# EAGLE schematic board 3 (EAGLE 9.6.2)
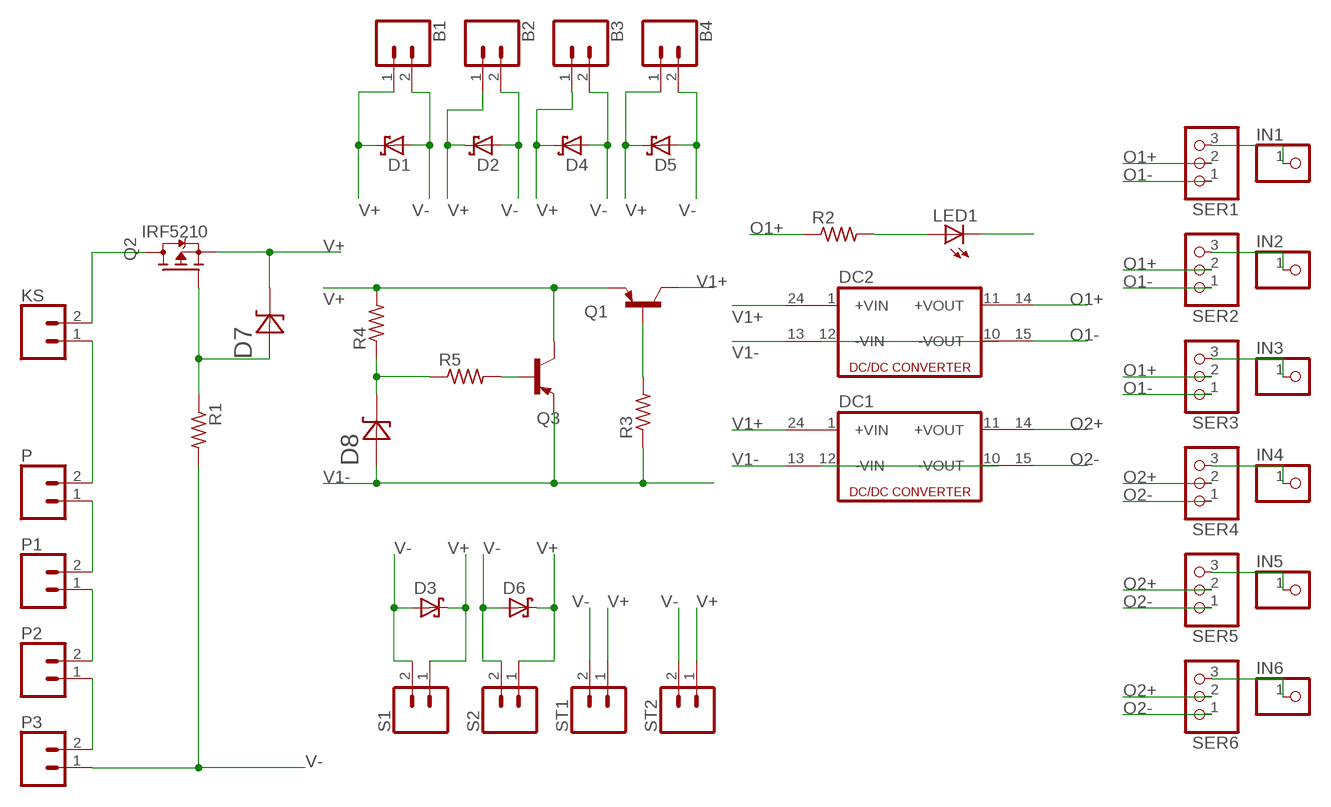
[diagram p0: schematic, sheet 1]

## Parts
B1  CONN_02  [1X02]
B2  CONN_02  [1X02]
B3  CONN_02  [1X02]
B4  CONN_02  [1X02]
D1  SCHOTTKY-DIODEF126Z12  [F126Z12]
D2  SCHOTTKY-DIODEF126Z12  [F126Z12]
D3  SCHOTTKY-DIODEF126Z12  [F126Z12]
D4  SCHOTTKY-DIODEF126Z12  [F126Z12]
D5  SCHOTTKY-DIODEF126Z12  [F126Z12]
D6  SCHOTTKY-DIODEF126Z12  [F126Z12]
D7  1N4752A-T  [DIOAD1060W80L410D260]
D8  1N4752A-T  [DIOAD1060W80L410D260]
DC1  DC213R  [CMK]
DC2  DC213R  [CMK]
IN1  PINHD-1X1  [1X01]
IN2  PINHD-1X1  [1X01]
IN3  PINHD-1X1  [1X01]
IN4  PINHD-1X1  [1X01]
IN5  PINHD-1X1  [1X01]
IN6  PINHD-1X1  [1X01]
KS  CONN_02  [1X02]
LED1  LED5MM  [LED5MM]
P  CONN_02  [1X02]
P1  CONN_02  [1X02]
P2  CONN_02  [1X02]
P3  CONN_02  [1X02]
Q1  2N2907  [TO92-EBC-OVAL]
Q2  IRF5210  [TO254P1054X469X2933-3]
Q3  2N2907  [TO92-EBC-OVAL]
R1  R-US_0204/7  [0204/7]
R2  R-US_0204/7  [0204/7]
R3  R-US_0204/7  [0204/7]
R4  R-US_0204/7  [0204/7]
R5  R-US_0204/7  [0204/7]
S1  CONN_02  [1X02]
S2  CONN_02  [1X02]
SER1  PINHD-1X3  [1X03]
SER2  PINHD-1X3  [1X03]
SER3  PINHD-1X3  [1X03]
SER4  PINHD-1X3  [1X03]
SER5  PINHD-1X3  [1X03]
SER6  PINHD-1X3  [1X03]
ST1  CONN_02  [1X02]
ST2  CONN_02  [1X02]

## Nets
N$1: KS.1 P.2
N$2: KS.2 Q2.2(D)
N$3: D7.A Q2.1(G) R1.1
N$4: P1.2 P.1
N$5: P1.1 P2.2
N$6: D8.C R4.1 R5.1
N$7: Q3.B R5.2
N$8: P2.1 P3.2
N$9: Q1.B R3.2
N$28: DC2.10(-VOUT) DC2.12(-VIN)
N$29: DC1.10(-VOUT) DC1.12(-VIN)
N$38: LED1.A R2.2
N$39: LED1.K(C)
N$53: IN1.1 SER1.3
N$54: IN2.1 SER2.3
N$55: IN3.1 SER3.3
N$56: IN4.1 SER4.3
N$57: IN5.1 SER5.3
N$58: IN6.1 SER6.3
O1+: DC2.14(+VOUT1) R2.1 SER1.2 SER2.2 SER3.2
O1-: DC2.15(-VOUT1) SER1.1 SER2.1 SER3.1
O2+: DC1.14(+VOUT1) SER4.2 SER5.2 SER6.2
O2-: DC1.15(-VOUT1) SER4.1 SER5.1 SER6.1
V1+: DC1.24(+VIN1) DC2.24(+VIN1) Q1.C
V1-: D8.A DC1.13(-VIN1) DC2.13(-VIN1) Q3.E R3.1
V+: B1.1 B2.1 B3.1 B4.1 D1.C D2.C D3.C D4.C D5.C D6.C D7.C Q1.E Q2.3(S) Q3.C R4.2 S1.1 S2.1 ST1.1 ST2.1
V-: B1.2 B2.2 B3.2 B4.2 D1.A D2.A D3.A D4.A D5.A D6.A P3.1 R1.2 S1.2 S2.2 ST1.2 ST2.2
Unconnected: DC1.1(+VIN) DC1.11(+VOUT) DC2.1(+VIN) DC2.11(+VOUT)

## Library data of the parts
B1-B4 KS P P1-P3 S1 S2 ST1 ST2 = SparkFun-Connectors:CONN_02: Multi connection point. Often used as Generic Header-pin footprint for 0.1 inch spaced/style header connections On any of the 0.1 inch spaced packages, you can populate with these: Break Away Headers - Straight <https://www.sparkfun.com/products/116> (PRT-00116) Break Away Male Headers - Right Angle <https://www.sparkfun.com/products/553> (PRT-00553) Female Headers <https://www.sparkfun.com/products/115> (PRT-00115) Break Away Headers - Machine Pin <https://www.sparkfun.com/products/117> (PRT-00117) Break Away Female Headers - Swiss Machine Pin <https://www.sparkfun.com/products/743> (PRT-00743) For SCREWTERMINALS and SPRING TERMINALS visit here: Screw Terimnals on SparkFun.com <https://www.sparkfun.com/search/results?term=Screw+Terminals> (5mm/3.5mm/2.54mm spacing) This device is also useful as a general connection point to wire up your design to another part of your project. Our various solder wires solder well into these plated through hole pads. Hook-Up Wire - Assortment (Stranded, 22 AWG) <https://www.sparkfun.com/products/11375> (PRT-11375) Hook-Up Wire - Assortment (Solid Core, 22 AWG) <https://www.sparkfun.com/products/11367> (PRT-11367) View the entire wire category on our website here <https://www.sparkfun.com/categories/141> Special notes: Molex polarized connector foot print use with: PRT-08233 with associated crimp pins and housings. 2.54_SCREWTERM for use with PRT-10571. 3.5mm Screw Terminal footprints for PRT-08084 5mm Screw Terminal footprints for use with PRT-08432
D1-D6 = adafruit:SCHOTTKY-DIODE: Schottky Diode
D7 D8 = 1N4752A-T:1N4752A-T: DIODE ZENER 33V 1W DO41 Check prices <https://pricing.snapeda.com/parts/1N4752A/ON%20Semiconductor/view-part?ref=eda>; AVAILABILITY: In Stock; DESCRIPTION: Zener Diode 33 V 1 W ±5% Through Hole DO-41; MF: ON Semiconductor; MP: 1N4752A; PACKAGE: DO-41-2 ON Semiconductor; PRICE: None; PURCHASE-URL: https://pricing.snapeda.com/search/part/1N4752A/?ref=eda
DC1 DC2 = dc-dc-converter:DC213R: DC-DC CONVERTER; OC_FARNELL: unknown; OC_NEWARK: unknown
IN1-IN6 = pinhead:PINHD-1X1: PIN HEADER
LED1 = adafruit:LED: LED OSRAM: - CHIPLED LG R971, LG N971, LY N971, LG Q971, LY Q971, LO R971, LY R971 LH N974, LH R974 LS Q976, LO Q976, LY Q976 LO Q996 - Hyper CHIPLED LW Q18S LB Q993, LB Q99A, LB R99A - SideLED LS A670, LO A670, LY A670, LG A670, LP A670 LB A673, LV A673, LT A673, LW A673 LH A674 LY A675 LS A676, LA A676, LO A676, LY A676, LW A676 LS A679, LY A679, LG A679 - Hyper Micro SIDELED® LS Y876, LA Y876, LO Y876, LY Y876 LT Y87S - SmartLED LW L88C, LW L88S LB L89C, LB L89S, LG L890 LS L89K, LO L89K, LY L89K LS L896, LA L896, LO L896, LY L896 - TOPLED LS T670, LO T670, LY T670, LG T670, LP T670 LSG T670, LSP T670, LSY T670, LOP T670, LYG T670 LG T671, LOG T671, LSG T671 LB T673, LV T673, LT T673, LW T673 LH T674 LS T676, LA T676, LO T676, LY T676, LB T676, LH T676, LSB T676, LW T676 LB T67C, LV T67C, LT T67C, LS T67K, LO T67K, LY T67K, LW E67C LS E67B, LA E67B, LO E67B, LY E67B, LB E67C, LV E67C, LT E67C LW T67C LS T679, LY T679, LG T679 LS T770, LO T770, LY T770, LG T770, LP T770 LB T773, LV T773, LT T773, LW T773 LH T774 LS E675, LA E675, LY E675, LS T675 LS T776, LA T776, LO T776, LY T776, LB T776 LHGB T686 LT T68C, LB T68C - Hyper Mini TOPLED® LB M676 - Mini TOPLED Santana® LG M470 LS M47K, LO M47K, LY M47K Source: http://www.osram.convergy.de/
Q1 Q3 = adafruit:2N2907*: PNP Transistor Big Oval pads
Q2 = IRF5210:IRF5210: Check prices <https://pricing.snapeda.com/parts/IRF5210/Infineon%20Technologies/view-part?ref=eda>; AVAILABILITY: In Stock; DESCRIPTION: P-Channel 100V 38A (Tc) 3.1W (Ta), 170W (Tc) Surface Mount D2PAK; MF: Infineon Technologies; MP: IRF5210; PACKAGE: TO-220 Infineon; PRICE: None; PURCHASE-URL: https://pricing.snapeda.com/search/part/IRF5210/?ref=eda
R1-R5 = rcl:R-US_: RESISTOR, American symbol; SPICEPREFIX: R
SER1-SER6 = pinhead:PINHD-1X3: PIN HEADER